# Altium schematic sheet SCP_Controller.SchDoc: SCP Fiber Controller (part 2 of 2)
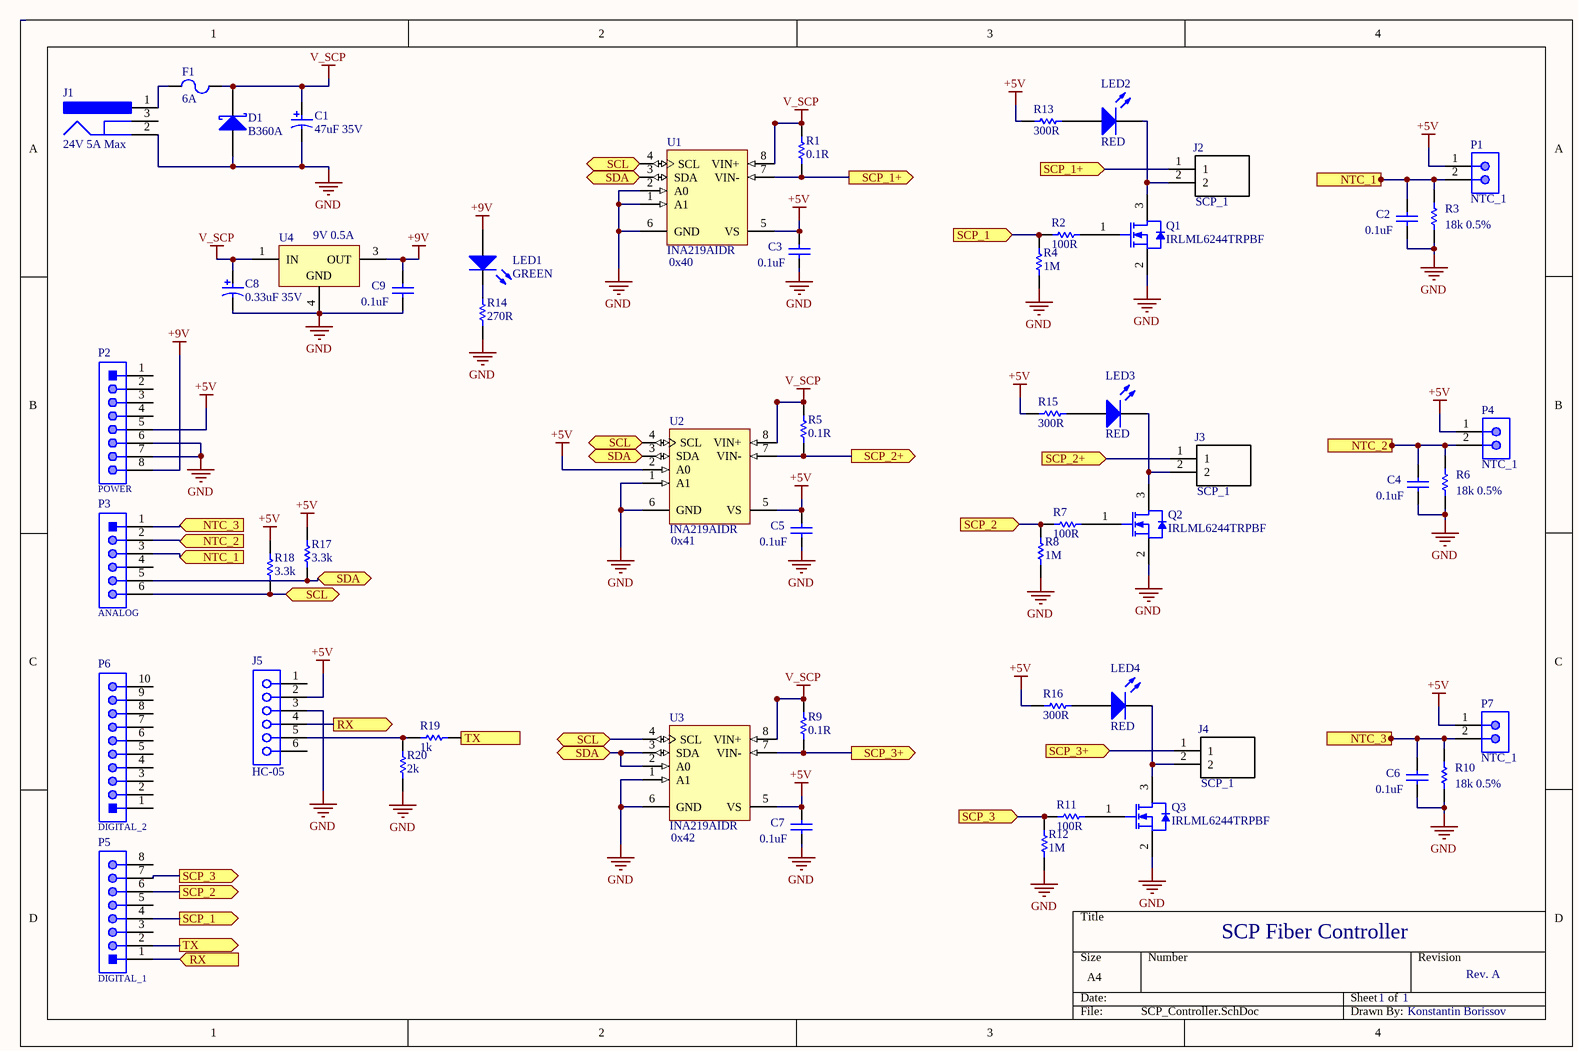
[diagram p1: SCP_Controller.SchDoc]

## Library data of the parts
C1 = CMP-2000-06216-1: Aluminum Electrolytic Capacitor, 47 uF, +/- 20%, 35 V, 2-Pin SMD (Size Code D), -55 to 105 degC, RoHS, Tape and Reel; Manufacturer: Panasonic; Manufacturer Part Number: EEE-1VA470WP; Ripple Current: 70mA; Life (Hours): 1000Hour; ComponentLink1URL: https://datasheet.ciiva.com/2983/aba0000ce2-2983927.pdf?src-supplier=Avnet; ComponentLink1Description: https://datasheet.ciiva.com/2983/aba0000ce2-2983927.pdf?src-supplier=Avnet; ComponentLink2URL: https://datasheet.ciiva.com/14598/70255710-14598937.pdf?src-supplier=Allied+Electronics; ComponentLink2Description: https://datasheet.ciiva.com/14598/70255710-14598937.pdf?src-supplier=Allied+Electronics; ComponentLink3URL: https://datasheet.ciiva.com/15165/getdatasheetpartid-86239-15165868.pdf?src-supplier=Verical; ComponentLink3Description: https://datasheet.ciiva.com/15165/getdatasheetpartid-86239-15165868.pdf?src-supplier=Verical; ComponentLink4URL: https://datasheet.ciiva.com/16507/aba0000ce2-16507965.pdf?src-supplier=Future+Electronics; ComponentLink4Description: https://datasheet.ciiva.com/16507/aba0000ce2-16507965.pdf?src-supplier=Future+Electronics; ComponentLink5URL: https://datasheet.ciiva.com/30206/11aba0000ce2-30206253.pdf?src-supplier=Onlinecomponents.com; ComponentLink5Description: https://datasheet.ciiva.com/30206/11aba0000ce2-30206253.pdf?src-supplier=Onlinecomponents.com; Supplier 1: Digi-Key; Supplier Part Number 1: PCE3961CT-ND; RoHS: Yes; Category: Aluminum Electrolytic Capacitors; Stock 1: 380414; Pricing 1: 1=0.41000, 10=0.28400, 100=0.17040, 500=0.12782 (USD); Mount: Surface Mount,PCB; Case/Package: Radial; Contact Plating: Tin; Min Operating Temperature: -40°C; Max Operating Temperature: 85°C; Capacitance: 47uF; Tolerance: 20%; Voltage Rating (DC): 35V; Voltage Rating: 35V; Packaging: Tape and Reel; Package Quantity: 1; Termination: SMD/SMT; Ripple Current (AC): 70mA; Diameter: 6.3mm; Length: 5.5mm; Height: 5.4mm; Height - Seated (Max): 0.213inch; Radiation Hardening: No; Lead Free: Lead Free; REACH SVHC: Unknown
C2-C7 C9 = CMP-2006-02353-1: Manufacturer: Murata; Manufacturer Part Number: GCJ188R71E104KA12D; Capacitance: 100nF; Tolerance: 10%; Voltage Rating: 25V; Supplier 1: Digi-Key; Supplier Part Number 1: 490-16477-1-ND; RoHS: No; Category: Ceramic Capacitors; Stock 1: 9578; Pricing 1: 1=0.20000, 10=0.13300, 100=0.06740, 500=0.04610, 1000=0.04079 (USD); Mount: Surface Mount; Case/Package: 0603; Case Code (Imperial): 0603; Case Code (Metric): 1608; Min Operating Temperature: -55°C; Max Operating Temperature: 125°C; Features: Soft Termination; Packaging: Tape and Reel; Ratings: AEC-Q200; ComponentLink1URL: http://search.murata.co.jp/Ceramy/image/img/A01X/G101/ENG/GCJ188R71E104KA12-01.pdf?src-supplier=Digi-Key; ComponentLink1Description: http://search.murata.co.jp/Ceramy/image/img/A01X/G101/ENG/GCJ188R71E104KA12-01.pdf?src-supplier=Digi-Key
C8 = CMP-2000-05172-1: Manufacturer: KEMET; Manufacturer Part Number: T491A334K035AT; Dielectric Material: Tantalum; Capacitance: 330nF; ESR (Equivalent Series Resistance): 15R; Tolerance: 10%; Leakage Current: 500nA; Polarity: Polar; Dissipation Factor: 4%; Life (Hours): 2000Hour; Supplier 1: Digi-Key; Supplier Part Number 1: 399-3693-1-ND; RoHS: Yes; Category: Tantalum Capacitors; Stock 1: 42469; Pricing 1: 1=0.45000, 10=0.31300, 100=0.18770, 500=0.14076, 1000=0.11886 (USD); Mount: Surface Mount,PCB; Case/Package: 1206; Number of Pins: 2; Case Code (Imperial): 1206; Case Code (Metric): 3216; Min Operating Temperature: -55°C; Max Operating Temperature: 125°C; Package Quantity: 1; Voltage Rating: 35V; Packaging: Tape and Reel; Voltage Rating (DC): 35V; Termination: SMD/SMT; Voltage: 35V; Features: General Purpose; Length: 3.2mm; Height: 1.6mm; Width: 1.6mm; Height - Seated (Max): 0.071inch; Depth: 1.6mm; Lead Pitch: 1.2mm; Radiation Hardening: No; REACH SVHC: No SVHC; Lead Free: Lead Free; ComponentLink1URL: https://datasheet.ciiva.com/34302/1573370-34302509.pdf?src-supplier=Jameco; ComponentLink1Description: https://datasheet.ciiva.com/34302/1573370-34302509.pdf?src-supplier=Jameco; ComponentLink2URL: https://datasheet.ciiva.com/7758/1446014-7758887.pdf?src-supplier=Element14; ComponentLink2Description: https://datasheet.ciiva.com/7758/1446014-7758887.pdf?src-supplier=Element14; ComponentLink3URL: https://datasheet.ciiva.com/7758/1698764-7758889.pdf?src-supplier=Element14; ComponentLink3Description: https://datasheet.ciiva.com/7758/1698764-7758889.pdf?src-supplier=Element14; ComponentLink4URL: https://datasheet.ciiva.com/257/kem-t2005-t491-257550.pdf?src-supplier=Digi-Key; ComponentLink4Description: https://datasheet.ciiva.com/257/kem-t2005-t491-257550.pdf?src-supplier=Digi-Key; ComponentLink5URL: https://datasheet.ciiva.com/7758/1446014-7758888.pdf?src-supplier=Element14; ComponentLink5Description: https://datasheet.ciiva.com/7758/1446014-7758888.pdf?src-supplier=Element14; ComponentLink6URL: https://datasheet.ciiva.com/7758/1446014-7758890.pdf?src-supplier=Element14; ComponentLink6Description: https://datasheet.ciiva.com/7758/1446014-7758890.pdf?src-supplier=Element14; ComponentLink7URL: https://datasheet.ciiva.com/5933/1446014-5933354.pdf?src-supplier=Farnell; ComponentLink7Description: https://datasheet.ciiva.com/5933/1446014-5933354.pdf?src-supplier=Farnell; ComponentLink8URL: https://datasheet.ciiva.com/14595/70095774-14595094.pdf?src-supplier=Allied+Electronics; ComponentLink8Description: https://datasheet.ciiva.com/14595/70095774-14595094.pdf?src-supplier=Allied+Electronics; ComponentLink9URL: https://datasheet.ciiva.com/257/kem-t2005-t491-257548.pdf?src-supplier=Digi-Key; ComponentLink9Description: https://datasheet.ciiva.com/257/kem-t2005-t491-257548.pdf?src-supplier=Digi-Key; ComponentLink10URL: https://datasheet.ciiva.com/14589/70095774-14589356.pdf?src-supplier=Allied+Electronics; ComponentLink10Description: https://datasheet.ciiva.com/14589/70095774-14589356.pdf?src-supplier=Allied+Electronics; ComponentLink11URL: https://datasheet.ciiva.com/257/kem-t2005-t491-257549.pdf?src-supplier=Digi-Key; ComponentLink11Description: https://datasheet.ciiva.com/257/kem-t2005-t491-257549.pdf?src-supplier=Digi-Key
D1 = CMP-2000-05898-1: Schottky Barrier Rectifier, 3 A, -55 to 150 degC, 2-Pin Molded, RoHS, Tape and Reel; Manufacturer: DiodesIncorporated; Manufacturer Part Number: B360A-13-F; Vf - Forward Voltage: 0.7V; Ifsm - Forward Surge Current: 80A; If - Forward Current: 3A; Unit Weight: 0.002258oz; Ir - Reverse Current: 500uA; Vrrm - Repetitive Reverse Voltage: 60V; Configuration: Single; Forward Voltage: 700mV; Polarity: Standard; Capacitance: 250pF; Length: 4.6mm; Datasheet Version: Rev. 15-2, 09/2014; Technology: Si; Factory Pack Quantity: 5000; Manufacturer URL: http://www.diodes.com/; Type: SchottkyBarrierRectifier; Product Category: SchottkyDiodes&Rectifiers; Minimum Operating Temperature: -55C; Packaging: Reel; Product: SchottkyDiodes; Height: 2.3mm; Datasheet URL: https://datasheet.ciiva.com/914/ds30891-914080.pdf; Series: B360; Brand: DiodesIncorporated; Maximum Operating Temperature: +125C; Termination Style: SMD/SMT; Package / Case: SMA; Mounting Style: SMD/SMT; RoHS: True; Package Description: 2-Pin Surface Mount Device, Body 4.3 x 2.605 mm; Operating Temperature Range: -55Cto+125C; Package Reference: B360A; Width: 2.92mm; Mounting Technology: SurfaceMount; Supplier 1: Digi-Key; Supplier Part Number 1: B360A-FDIDKR-ND; Category: Schottky Diodes; Stock 1: 514772; Pricing 1: 1=0.38000, 10=0.30800, 100=0.17690, 500=0.16380, 1000=0.11138 (USD); Mount: Surface Mount; Case/Package: SMA; Number of Pins: 2; Weight: 0.002258oz; Contact Plating: Tin,Matte; Min Operating Temperature: -55°C; Max Operating Temperature: 150°C; Forward Current: 3A; Max Repetitive Reverse Voltage (Vrrm): 60V; Element Configuration: Single; Peak Reverse Current: 500uA; Max Forward Surge Current (Ifsm): 80A; Peak Non-Repetitive Surge Current: 80A; Package Quantity: 5000; Average Rectified Current: 3A; Termination: SMD/SMT; Voltage Rating (DC): 60V; Current Rating: 3A; Output Current: 3A; Max Reverse Voltage (DC): 60V; Radiation Hardening: No; REACH SVHC: No SVHC; Lead Free: Lead Free; ComponentLink1URL: https://datasheet.ciiva.com/914/ds30891-914080.pdf?src-supplier=Digi-Key; ComponentLink1Description: https://datasheet.ciiva.com/914/ds30891-914080.pdf?src-supplier=Digi-Key; ComponentLink2URL: https://datasheet.ciiva.com/4244/861ds30891-4244631.pdf?src-supplier=Arrow; ComponentLink2Description: https://datasheet.ciiva.com/4244/861ds30891-4244631.pdf?src-supplier=Arrow; ComponentLink3URL: https://datasheet.ciiva.com/34302/1538902-34302361.pdf?src-supplier=Jameco; ComponentLink3Description: https://datasheet.ciiva.com/34302/1538902-34302361.pdf?src-supplier=Jameco; ComponentLink4URL: https://datasheet.ciiva.com/26788/b360a-13-f-26788524.pdf?src-supplier=IIIC; ComponentLink4Description: https://datasheet.ciiva.com/26788/b360a-13-f-26788524.pdf?src-supplier=IIIC; ComponentLink5URL: https://datasheet.ciiva.com/914/ds30891-914081.pdf?src-supplier=Digi-Key; ComponentLink5Description: https://datasheet.ciiva.com/914/ds30891-914081.pdf?src-supplier=Digi-Key; ComponentLink6URL: https://datasheet.ciiva.com/1177/ds30891-1177482.pdf?src-supplier=Element14; ComponentLink6Description: https://datasheet.ciiva.com/1177/ds30891-1177482.pdf?src-supplier=Element14; ComponentLink7URL: https://datasheet.ciiva.com/914/ds30891-914082.pdf?src-supplier=Digi-Key; ComponentLink7Description: https://datasheet.ciiva.com/914/ds30891-914082.pdf?src-supplier=Digi-Key; ComponentLink8URL: https://datasheet.ciiva.com/25919/ds30891-25919703.pdf?src-supplier=Avnet+Europe; ComponentLink8Description: https://datasheet.ciiva.com/25919/ds30891-25919703.pdf?src-supplier=Avnet+Europe; ComponentLink9URL: https://datasheet.ciiva.com/22695/1911813-22695787.pdf?src-supplier=Element14; ComponentLink9Description: https://datasheet.ciiva.com/22695/1911813-22695787.pdf?src-supplier=Element14; ComponentLink10URL: https://datasheet.ciiva.com/16199/ds13005-16199422.pdf?src-supplier=Future+Electronics; ComponentLink10Description: https://datasheet.ciiva.com/16199/ds13005-16199422.pdf?src-supplier=Future+Electronics
F1 = CMP-2000-05753-1: Manufacturer: Bel TRP; Manufacturer Part Number: C1F6; Voltage Rating (AC): 125V; Voltage Rating (DC): 63V; DC Cold Resistance: 15mR; Fuse Type: Board Mount (Cartridge Style Excluded); Approvals: CE,cURus; Supplier 1: Digi-Key; Supplier Part Number 1: 507-1887-1-ND; RoHS: Yes; Category: Fuses; Stock 1: 11906; Pricing 1: 1=0.29000, 5=0.27800, 10=0.26500, 50=0.23660, 100=0.22030, 250=0.19584, 500=0.16320, 1000=0.15504 (USD); Mount: Surface Mount; Case/Package: 1206; Number of Pins: 2; Case Code (Metric): 3216; Case Code (Imperial): 1206; Contact Plating: Tin; Min Operating Temperature: -55°C; Max Operating Temperature: 125°C; Packaging: Tape and Reel; Current Rating: 6A; Max Voltage Rating (DC): 63V; Voltage Rating: 125V; Length: 0.126inch; Width: 0.062inch; ComponentLink1URL: http://www.farnell.com/datasheets/2571625.pdf?src-supplier=Farnell; ComponentLink1Description: http://www.farnell.com/datasheets/2571625.pdf?src-supplier=Farnell; ComponentLink2URL: http://www.mouser.com/ds/2/643/C1F-594910.pdf?src-supplier=Mouser; ComponentLink2Description: http://www.mouser.com/ds/2/643/C1F-594910.pdf?src-supplier=Mouser; ComponentLink3URL: http://belfuse.com/pdfs/C1F.pdf?src-supplier=Avnet+Asia; ComponentLink3Description: http://belfuse.com/pdfs/C1F.pdf?src-supplier=Avnet+Asia; ComponentLink4URL: http://belfuse.com/pdfs/C1F.pdf?src-supplier=Avnet; ComponentLink4Description: http://belfuse.com/pdfs/C1F.pdf?src-supplier=Avnet; ComponentLink5URL: https://belfuse.com/resources/datasheets/circuitprotection/ds-cp-c1f-series.pdf?src-supplier=Digi-Key; ComponentLink5Description: https://belfuse.com/resources/datasheets/circuitprotection/ds-cp-c1f-series.pdf?src-supplier=Digi-Key
J1 = CMP-2000-06899-1: DC Power Jack, 5 A, -25 to 85 degC, 3-Pin THD, RoHS; Manufacturer: CUI; Manufacturer Part Number: PJ-102AH; Gender: Male; Shielding: Unshielded; Insulation Resistance: 50MR; Number of Conductors: 2; ComponentLink1URL: http://www.mouser.com/ds/2/670/PJ-102AH-524179.pdf?src-supplier=Mouser; ComponentLink1Description: http://www.mouser.com/ds/2/670/PJ-102AH-524179.pdf?src-supplier=Mouser; ComponentLink2URL: http://www.cui.com/Product/Resource/FuturePDF/PJ-102AH.pdf?src-supplier=Future+Electronics; ComponentLink2Description: http://www.cui.com/Product/Resource/FuturePDF/PJ-102AH.pdf?src-supplier=Future+Electronics; ComponentLink3URL: https://www.cui.com/product/resource/digikeypdf/pj-102ah.pdf?src-supplier=Digi-Key; ComponentLink3Description: https://www.cui.com/product/resource/digikeypdf/pj-102ah.pdf?src-supplier=Digi-Key; Supplier 1: Digi-Key; Supplier Part Number 1: CP-102AH-ND; RoHS: Yes; Category: Connectors; Stock 1: 92806; Pricing 1: 1=0.76000, 10=0.70800, 25=0.63720, 50=0.56640, 100=0.54280, 250=0.49560, 500=0.47200, 1000=0.38940, 2500=0.35400 (USD); Mount: Through Hole; Color: Black; Contact Material: Copper; Contact Plating: Nickel; Housing Color: Black; Housing Material: Thermoplastic; Min Operating Temperature: -25°C; Max Operating Temperature: 85°C; Current Rating: 5A; Termination: Through Hole; Connector Type: Jack; Packaging: Bulk; Package Quantity: 280; Contact Gender: Male; Voltage Rating: 24V; Orientation: Horizontal; Diameter: 2.1mm; Lead Free: Lead Free; Flammability Rating: UL94 V-0
J2-J4 = TBP02R1-381-02BE: Manufacturer: CUI; Value: *; Supplier 1: Digi-Key; Supplier Part Number 1: 102-6480-ND; Manufacturer Part Number: TBP02R1-381-02BE; RoHS: No; Stock 1: 924; Pricing 1: 1=0.47000, 10=0.24600, 25=0.17440, 50=0.14820, 100=0.14300, 250=0.12092, 500=0.11180, 1000=0.09880, 5000=0.07540 (USD)
J5 = CMP-1023-00360-1: SQ Post Socket, Through-hole, Vertical, -55 to 105 degC, 2.54mm Pitch, 6-Pin, Female, RoHS; Manufacturer: Samtec; PartNumber: SSW-106-02-T-S; Manufacturer Part Number: PPPC061LFBN-RC; Description: CONN HDR 6POS 0.1 GOLD PCB; Number of Positions: 6; Connector Type: Header,Socket; ComponentLink1URL: http://www.samtec.com; Temperature Range: -55 to 105 degC; Pitch: 2.54 mm; Mounting Technology: Through-hole; DatasheetVersion: F-214; ComponentLink1Description: Manufacturer URL; PackageVersion: CA, 6/1987; ComponentLink3Description: Package Specification; PackageDescription: Assembly, Socket Strip .016 X .031 Tail; ComponentLink2Description: Datasheet; ComponentLink2URL: http://www.samtec.com/documents/webfiles/pdf/SSW_TH.PDF; PackageReference: SSW-106-02-X-S; ComponentLink3URL: http://www.samtec.com/documents/webfiles/cpdf/SSW-1XX-XX-XXX-X-XX-XXX-XX-MKT.pdf; RoHS: True; Orientation: Vertical; Supplier 1: Digi-Key; Supplier Part Number 1: S7039-ND; Category: Connectors; Stock 1: 24151; Pricing 1: 1=0.53000, 10=0.50000, 100=0.38300, 500=0.33300, 1000=0.27473, 5000=0.24143, 10000=0.24050 (USD); Mount: Through Hole; Color: Black; Contact Plating: Gold; Contact Material: Bronze; Housing Material: Plastic; Package Quantity: 1000; Number of Rows: 1; Packaging: Bulk; Termination: Solder; Length: 15.7mm; Height: 8.5mm; Width: 2.5mm; Lead Free: Lead Free; ComponentLink4URL: https://media.digikey.com/pdf/Data%20Sheets/Sullins%20PDFs/Female_Headers.100_DS.pdf?src-supplier=Digi-Key; ComponentLink4Description: https://media.digikey.com/pdf/Data%20Sheets/Sullins%20PDFs/Female_Headers.100_DS.pdf?src-supplier=Digi-Key
LED1 = CMP-1426-00006-1: SMD mono-color Chip LED, WL-SMCW, Bright Green; PartNumber: 150060VS75000; Manufacturer: Wuerth Elektronik; Luminous Intensity: 40mcd; Viewing Angle: 140°; Forward Voltage: 2V; Wavelength: 570nm; Lens Style: Clear,Rectangular; Forward Current: 30mA; Test Current: 20mA; ComponentLink2URL: http://katalog.we-online.com/led/datasheet/150060VS75000.pdf; ComponentLink1Description: Manufacturer URL; PackageReference: 0603_A; ComponentLink2Description: Datasheet; ComponentLink1URL: http://www.we-online.com; Color: Bright Green; Supplier 1: Digi-Key; Supplier Part Number 1: 732-4980-1-ND; Manufacturer Part Number: 150060VS75000; RoHS: Yes; Category: LEDs; Stock 1: 59962; Pricing 1: 1=0.14000, 50=0.13300, 100=0.11400, 500=0.09900 (USD); Mount: Surface Mount; Case/Package: 0603; Number of Pins: 2; Case Code (Metric): 1608; Case Code (Imperial): 0603; Min Operating Temperature: -40°C; Max Operating Temperature: 85°C; Package Quantity: 1; Packaging: Tape and Reel; Dominant Wavelength: 570nm; Length: 1.6mm; Height: 0.7mm; Width: 0.8mm; REACH SVHC: Unknown; ComponentLink3URL: https://datasheet.ciiva.com/23843/150060vs75000-23843249.pdf?src-supplier=Newark; ComponentLink3Description: https://datasheet.ciiva.com/23843/150060vs75000-23843249.pdf?src-supplier=Newark; ComponentLink4URL: https://datasheet.ciiva.com/29279/759431-da-01-en-chipled-0603-w-kl-h-gruen-150060vs7500-29279199.pdf?src-supplier=Conrad; ComponentLink4Description: https://datasheet.ciiva.com/29279/759431-da-01-en-chipled-0603-w-kl-h-gruen-150060vs7500-29279199.pdf?src-supplier=Conrad; ComponentLink5URL: https://datasheet.ciiva.com/29562/150060vs75000-29562919.pdf?src-supplier=Digi-Key; ComponentLink5Description: https://datasheet.ciiva.com/29562/150060vs75000-29562919.pdf?src-supplier=Digi-Key; ComponentLink6URL: https://datasheet.ciiva.com/29562/150060vs75000-29562920.pdf?src-supplier=Digi-Key; ComponentLink6Description: https://datasheet.ciiva.com/29562/150060vs75000-29562920.pdf?src-supplier=Digi-Key; ComponentLink7URL: https://datasheet.ciiva.com/29562/150060vs75000-29562921.pdf?src-supplier=Digi-Key; ComponentLink7Description: https://datasheet.ciiva.com/29562/150060vs75000-29562921.pdf?src-supplier=Digi-Key; ComponentLink8URL: https://datasheet.ciiva.com/48430/150060vs75000-eng-tds-48430043.pdf?src-supplier=Distrelec; ComponentLink8Description: https://datasheet.ciiva.com/48430/150060vs75000-eng-tds-48430043.pdf?src-supplier=Distrelec
LED2-LED4 = CMP-1426-00001-1: SMD mono-color Chip LED, WL-SMCW, Red; Manufacturer: Wuerth Elektronik; PartNumber: 150060RS75000; Viewing Angle: 140°; Lens Style: Clear,Rectangular; Luminous Intensity: 250mcd; Forward Current: 30mA; Forward Voltage: 2V; Wavelength: 625nm; Test Current: 20mA; Color: Red; PackageReference: 0603_A; ComponentLink2URL: http://katalog.we-online.com/led/datasheet/150060RS75000.pdf; ComponentLink1URL: http://www.we-online.com; ComponentLink1Description: Manufacturer URL; ComponentLink2Description: Datasheet; Supplier 1: Digi-Key; Supplier Part Number 1: 732-4978-1-ND; Manufacturer Part Number: 150060RS75000; RoHS: Yes; Category: LEDs; Stock 1: 19848; Pricing 1: 1=0.14000, 50=0.13300, 100=0.11400, 500=0.09900 (USD); Mount: Surface Mount; Case/Package: 0603; Case Code (Metric): 1608; Case Code (Imperial): 0603; Min Operating Temperature: -40°C; Max Operating Temperature: 85°C; Package Quantity: 1; Packaging: Cut Tape; Dominant Wavelength: 625nm; Length: 1.6mm; Height: 0.7mm; Width: 0.8mm; REACH SVHC: Unknown; ComponentLink3URL: https://datasheet.ciiva.com/29563/150060rs75000-29563040.pdf?src-supplier=Digi-Key; ComponentLink3Description: https://datasheet.ciiva.com/29563/150060rs75000-29563040.pdf?src-supplier=Digi-Key; ComponentLink4URL: https://datasheet.ciiva.com/29279/759428-da-01-en-chipled-0603-w-kl-rot-150060rs75000-29279196.pdf?src-supplier=Conrad; ComponentLink4Description: https://datasheet.ciiva.com/29279/759428-da-01-en-chipled-0603-w-kl-rot-150060rs75000-29279196.pdf?src-supplier=Conrad
P1 P4 P7 = CMP-2000-05888-1: Male Header, Pitch 2.5 mm, 1 x 2 Position, Height 7 mm, Tail Length 3.4 mm, -25 to 85 degC, RoHS, Bulk; Manufacturer: JST; No of Positions: 2; Pitch: 2.5mm; Style/Orientation: StraightHeader/Plug; Datasheet Version: 05/2016; Package Description: Male Header, Pitch 2.5 mm, 1 x 2 Position, Height 7 mm, Tail Length 3.4 mm; Package Reference: B2B-XH-A; Mounting Technology: ThroughHole; Type: ShroudedHeader; Datasheet URL: http://www.jst-mfg.com/product/pdf/eng/eXH.pdf; Manufacturer URL: http://www.jst.com/home2.html; Termination: Crimp; Supplier 1: Digi-Key; Supplier Part Number 1: 455-2247-ND
P2 P5 = CMP-1502-01076-1: THT Vertical Pin Header WR-PHD, Pitch 2.54 mm, Single Row, 8 pins; Manufacturer: Wurth Elektronik; Rated Current: 3A; Pin Number: 8; Working Voltage: 250VAC; Gender: Male; Contact Resistance: 20mOhm; Pitch: 2.54mm; Withstanding Voltage: 500VAC; Publisher: WurthElektronik; Operating Temperature: -40to105degC; Orientation: Vertical; Row Number: Single; Part Number: 61300811121; Package Reference: 61300811121; Mounting Technology: THT; Packaging: Bag; Manufacturer URL: http://www.we-online.de; Datasheet URL: https://katalog.we-online.de/em/datasheet/6130xx11121.pdf; Supplier 1: Digi-Key; Supplier Part Number 1: 732-5321-ND
P3 = CMP-1502-01070-1: THT Vertical Pin Header WR-PHD, Pitch 2.54 mm, Single Row, 6 pins; Manufacturer: Wurth Elektronik; Gender: Male; Pin Number: 6; Pitch: 2.54mm; Working Voltage: 250VAC; Rated Current: 3A; Withstanding Voltage: 500VAC; Contact Resistance: 20mOhm; Operating Temperature: -40to105degC; Packaging: Bag; Datasheet URL: https://katalog.we-online.de/em/datasheet/6130xx11121.pdf; Package Reference: 61300611121; Mounting Technology: THT; Publisher: WurthElektronik; Part Number: 61300611121; Manufacturer URL: http://www.we-online.de; Row Number: Single; Orientation: Vertical; Supplier 1: Digi-Key; Supplier Part Number 1: 732-5319-ND
P6 = CMP-1502-01082-1: THT Vertical Pin Header WR-PHD, Pitch 2.54 mm, Single Row, 10 pins; Manufacturer: Wurth Elektronik; Contact Resistance: 20mOhm; Rated Current: 3A; Pitch: 2.54mm; Gender: Male; Pin Number: 10; Working Voltage: 250VAC; Withstanding Voltage: 500VAC; Manufacturer URL: http://www.we-online.de; Operating Temperature: -40to105degC; Datasheet URL: https://katalog.we-online.de/em/datasheet/6130xx11121.pdf; Row Number: Single; Orientation: Vertical; Part Number: 61301011121; Packaging: Bag; Package Reference: 61301011121; Mounting Technology: THT; Publisher: WurthElektronik; Supplier 1: Digi-Key; Supplier Part Number 1: 732-2670-ND
Q1-Q3 = CMP-2000-06486-1: HEXFET(R) Power MOSFET / , 20 V, -55 to 150 degC, 3-Pin SOT-23, RoHS, Tape and Reel; Manufacturer: International Rectifier; Maximum Drain Source Voltage: 20V; Typical Turn-On Delay Time: 4.9ns; Typical Gate Charge @ Vgs: 8.9nC@4.5V; Maximum Continuous Drain Current: 6.3A; Channel Type: N; Channel Mode: Enhancement; Number of Elements per Chip: 1; Maximum Gate Threshold Voltage: 1.1V; Typical Input Capacitance @ Vds: 700pF@16V; Maximum Gate Source Voltage: ±12V; Transistor Material: Si; Maximum Drain Source Resistance: 0.027Ω; Minimum Gate Threshold Voltage: 0.5V; Transistor Configuration: Single; Maximum Power Dissipation: 1.3W; Typical Turn-Off Delay Time: 19ns; Category: PowerMOSFET; Manufacturer URL: http://internationalrectifier.com/; Datasheet Version: 03/2012; Mounting Type: SurfaceMount; Length: 3.04mm; Width: 1.4mm; Maximum Operating Temperature: +150°C; Height: 1.02mm; Datasheet URL: http://www.irf.com/product-info/datasheets/data/irlml6244pbf.pdf; Package Reference: SOT-23; Package Description: 3-Pin Small Outline Transistor, Body 2.92 x 1.3 mm, Pitch 0.95 mm; Minimum Operating Temperature: -55°C; Pin Count: 3; Dimensions: 3.04x1.4x1.02mm; Package Type: SOT-23; Mounting Technology: SurfaceMount; Supplier 1: Digi-Key; Supplier Part Number 1: IRLML6244TRPBFCT-ND
R1 R5 R9 = CMP-2000-07420-1: RES 0.1 OHM 1% 1W 2512; Manufacturer: Yageo; Manufacturer Part Number: RL2512FK-070R1L; Resistance: 100mR; Tolerance: 5%; Voltage Rating: 500V; Temperature Coefficient: 600ppm/°C; Supplier 1: Digi-Key; Supplier Part Number 1: 311-0.1TCT-ND; RoHS: Yes; Category: Chip SMD Resistors; Stock 1: 28825; Pricing 1: 1=0.54000, 10=0.38200, 100=0.19890, 1000=0.10709 (USD); Case/Package: 2512; Case Code (Imperial): 2512; Case Code (Metric): 6432; Contact Plating: Tin,Lead; Min Operating Temperature: -55°C; Max Operating Temperature: 155°C; Power Rating: 1W; Packaging: Tape and Reel; Package Quantity: 4000; Termination: SMD/SMT; Composition: Thick Film; Number of Terminations: 2; Max Power Dissipation: 1W; Features: Moisture Resistant; Length: 0.25inch; Height: 0.026inch; Width: 0.126inch; REACH SVHC: Unknown; Lead Free: Lead Free; ComponentLink1URL: https://datasheet.ciiva.com/22698/1747499-22698992.pdf?src-supplier=Element14; ComponentLink1Description: https://datasheet.ciiva.com/22698/1747499-22698992.pdf?src-supplier=Element14; ComponentLink2URL: https://datasheet.ciiva.com/5558/pyu-rl-521-rohs-l-5-5558076.pdf?src-supplier=Mouser; ComponentLink2Description: https://datasheet.ciiva.com/5558/pyu-rl-521-rohs-l-5-5558076.pdf?src-supplier=Mouser
R2 R7 R11 = CMP-2100-03669-1: Chip Resistor, 100 Ohm, +/-1%, 0.125 W, -55 to 155 degC, 0805 (2012 Metric), RoHS, Tape and Reel; Manufacturer: Yageo; Manufacturer Part Number: RC0805FR-07100RL; Power Rating: 125mW; Resistance: 100Ohm; Voltage Rating: 150V; Tolerance: 1%; Temperature Coefficient: 100ppm/degreesC; Length: 2mm; Package Description: 2-Pin Surface Mounted Device, Body 2 x 1.25 mm; Case Code (Imperial): 0805; Number of Pins: 2; Termination: SMD/SMT; Lead Pitch: 0.4mm; Package Quantity: 1; Height: 0.024inch; Case Code (Metric): 2012; Number of Terminations: 2; Datasheet Version: Rev. 5, 10/2016; Lead Free: LeadFree; Package Reference: 0805; Composition: ThickFilm; REACH SVHC: Unknown; Voltage Rating (DC): 150V; Min Operating Temperature: -55degC; Packaging: TapeandReel; Military Standard: Not; Case/Package: 0805; Datasheet URL: http://www.yageo.com/NewPortal/yageodocoutput?fileName=/pdf/R-Chip/PYu-RC_Group_51_RoHS_L_5.pdf; Max Operating Temperature: 155degC; Manufacturer URL: http://www.yageo.com/; Max Power Dissipation: 125mW; Width: 0.049inch; Depth: 1.25mm; RoHSCompliant: true; Supplier 1: Digi-Key; Supplier Part Number 1: 311-100CRCT-ND; RoHS: Yes; Category: Chip SMD Resistors; Stock 1: 7597433; Pricing 1: 1=0.10000, 10=0.04000, 100=0.01630, 1000=0.00731, 2500=0.00635 (USD); Features: Moisture Resistant; ComponentLink1URL: https://datasheet.ciiva.com/7941/1697719-7941680.pdf?src-supplier=Element14; ComponentLink1Description: https://datasheet.ciiva.com/7941/1697719-7941680.pdf?src-supplier=Element14; ComponentLink2URL: https://datasheet.ciiva.com/11808/0900766b8106beab-11808877.pdf?src-supplier=RSComponents; ComponentLink2Description: https://datasheet.ciiva.com/11808/0900766b8106beab-11808877.pdf?src-supplier=RSComponents; ComponentLink3URL: https://datasheet.ciiva.com/17082/rc0805-17082697.pdf?src-supplier=Future+Electronics; ComponentLink3Description: https://datasheet.ciiva.com/17082/rc0805-17082697.pdf?src-supplier=Future+Electronics; ComponentLink4URL: https://datasheet.ciiva.com/46447/444164-46447562.pdf?src-supplier=Element14; ComponentLink4Description: https://datasheet.ciiva.com/46447/444164-46447562.pdf?src-supplier=Element14; ComponentLink5URL: https://datasheet.ciiva.com/2456/pyu-r-int-thick-7-2456987.pdf?src-supplier=Digi-Key; ComponentLink5Description: https://datasheet.ciiva.com/2456/pyu-r-int-thick-7-2456987.pdf?src-supplier=Digi-Key; ComponentLink6URL: https://datasheet.ciiva.com/2456/pyu-r-int-thick-7-2456988.pdf?src-supplier=Digi-Key; ComponentLink6Description: https://datasheet.ciiva.com/2456/pyu-r-int-thick-7-2456988.pdf?src-supplier=Digi-Key; ComponentLink7URL: https://datasheet.ciiva.com/2456/pyu-r-int-thick-7-2456989.pdf?src-supplier=Digi-Key; ComponentLink7Description: https://datasheet.ciiva.com/2456/pyu-r-int-thick-7-2456989.pdf?src-supplier=Digi-Key; ComponentLink8URL: https://datasheet.ciiva.com/7660/38627-7660797.pdf?src-supplier=Element14; ComponentLink8Description: https://datasheet.ciiva.com/7660/38627-7660797.pdf?src-supplier=Element14; ComponentLink9URL: https://datasheet.ciiva.com/7941/1686128-7941679.pdf?src-supplier=Element14; ComponentLink9Description: https://datasheet.ciiva.com/7941/1686128-7941679.pdf?src-supplier=Element14; ComponentLink10URL: https://datasheet.ciiva.com/22747/444164-22747535.pdf?src-supplier=Element14; ComponentLink10Description: https://datasheet.ciiva.com/22747/444164-22747535.pdf?src-supplier=Element14
R3 R6 R10 = CMP-2001-00364-1: Manufacturer: Panasonic; Manufacturer Part Number: ERA-6AED183V; Resistance: 18kR; Power Rating: 125mW; Voltage Rating: 100V; Temperature Coefficient: 25ppm/°C; Supplier 1: Digi-Key; Supplier Part Number 1: P123817CT-ND; RoHS: Yes; Category: Chip SMD Resistors; Stock 1: 15192; Pricing 1: 1=0.11000, 10=0.10300, 25=0.07120, 50=0.05540, 100=0.03960, 250=0.03088, 500=0.02456, 1000=0.01742 (USD); Mount: Surface Mount; Case/Package: 0805; Case Code (Imperial): 0805; Case Code (Metric): 2012; Contact Plating: Tin; Min Operating Temperature: -55°C; Max Operating Temperature: 155°C; Package Quantity: 5000; Packaging: Tape and Reel; Tolerance: 0.5%; Composition: Thin Film; Military Standard: Not; Length: 2mm; Height: 0.5mm; Width: 1.25mm; Depth: 1.25mm; Lead Free: Lead Free; ComponentLink1URL: https://datasheet.ciiva.com/9192/aoa0000ce26-9192506.pdf?src-supplier=Avnet; ComponentLink1Description: https://datasheet.ciiva.com/9192/aoa0000ce26-9192506.pdf?src-supplier=Avnet
R4 R8 R12 = CMP-2001-00364-1: Manufacturer: Yageo; Manufacturer Part Number: RC0805FR-071ML; Resistance: 1MR; Tolerance: 1%; Temperature Coefficient: 100ppm/°C; Power Rating: 125mW; Voltage Rating: 150V; Supplier 1: Digi-Key; Supplier Part Number 1: 311-1.00MCRCT-ND; RoHS: Yes; Category: Chip SMD Resistors; Stock 1: 5090865; Pricing 1: 1=0.100000, 10=0.040000, 100=0.016300, 1000=0.007310, 2500=0.006350 (USD); Case/Package: 0805; Case Code (Metric): 2012; Case Code (Imperial): 0805; Min Operating Temperature: -55°C; Max Operating Temperature: 155°C; Composition: Thick Film; Packaging: Tape and Reel; Package Quantity: 1; Number of Terminations: 2; Termination: SMD/SMT; Military Standard: Not; Max Power Dissipation: 125mW; Features: Moisture Resistant; Length: 0.079inch; Height: 0.024inch; Width: 0.049inch; Depth: 1.25mm; REACH SVHC: Unknown; Lead Free: Lead Free; ComponentLink1URL: https://datasheet.ciiva.com/2519/pyu-r-int-thick-7-2519713.pdf?src-supplier=Digi-Key; ComponentLink1Description: https://datasheet.ciiva.com/2519/pyu-r-int-thick-7-2519713.pdf?src-supplier=Digi-Key; ComponentLink2URL: https://datasheet.ciiva.com/12666/rc0805-12666975.pdf?src-supplier=Mouser; ComponentLink2Description: https://datasheet.ciiva.com/12666/rc0805-12666975.pdf?src-supplier=Mouser; ComponentLink3URL: https://datasheet.ciiva.com/2519/pyu-r-int-thick-7-2519712.pdf?src-supplier=Digi-Key; ComponentLink3Description: https://datasheet.ciiva.com/2519/pyu-r-int-thick-7-2519712.pdf?src-supplier=Digi-Key; ComponentLink4URL: https://datasheet.ciiva.com/17419/rc0805-17419909.pdf?src-supplier=Future+Electronics; ComponentLink4Description: https://datasheet.ciiva.com/17419/rc0805-17419909.pdf?src-supplier=Future+Electronics; ComponentLink5URL: https://datasheet.ciiva.com/2519/pyu-r-int-thick-7-2519711.pdf?src-supplier=Digi-Key; ComponentLink5Description: https://datasheet.ciiva.com/2519/pyu-r-int-thick-7-2519711.pdf?src-supplier=Digi-Key
R13 R15 R16 = CMP-2000-06960-1: Chip Resistor, 300 Ohm, +/- 1%, 125 mW, -55 to 155 degC, 0805 (2012 Metric), RoHS, Tape and Reel; Manufacturer: Yageo; Manufacturer Part Number: RC0805FR-07300RL; Voltage Rating: 150V; Temperature Coefficient: 100PPM/C; Power Rating: 125mW(1/8W); Datasheet Version: Rev. 7, 05/2017; Termination Style: SMD/SMT; Case Code - mm: 2012; Package Description: 2-Pin Surface Mounted Device, Body 2 x 1.25 mm; Operating Temperature Range: -55Cto+155C; Case Code - in: 0805; Packaging: Reel; Tolerance: 1%; Package Reference: 0805; Mounting Technology: SurfaceMount; Product: ThickFilmResistorsGeneralPurpose; Series: RC; Manufacturer URL: http://www.yageo.com/; Datasheet URL: http://www.yageo.com/documents/recent/PYu-RC_Group_51_RoHS_L_7.pdf; Supplier 1: Digi-Key; Supplier Part Number 1: 311-300CRCT-ND; RoHS: Yes; Category: Chip SMD Resistors; Stock 1: 1132617; Pricing 1: 1=0.10000, 10=0.04000, 100=0.01630, 1000=0.00731, 2500=0.00635 (USD); Mount: Surface Mount; Case/Package: 0805; Case Code (Imperial): 0805; Case Code (Metric): 2012; Min Operating Temperature: -55°C; Max Operating Temperature: 155°C; Resistance: 300R; Termination: SMD/SMT; Military Standard: Not; Composition: Thick Film; Voltage Rating (DC): 150V; Number of Terminations: 2; Working Voltage: 150V; Length: 2mm; Height: 0.5mm; Depth: 1.25mm; Lead Free: Lead Free; ComponentLink1URL: https://datasheet.ciiva.com/11819/0900766b8106beab-11819824.pdf?src-supplier=RSComponents; ComponentLink1Description: https://datasheet.ciiva.com/11819/0900766b8106beab-11819824.pdf?src-supplier=RSComponents; ComponentLink2URL: https://datasheet.ciiva.com/5558/rc0805-5558042.pdf?src-supplier=Mouser; ComponentLink2Description: https://datasheet.ciiva.com/5558/rc0805-5558042.pdf?src-supplier=Mouser; ComponentLink3URL: https://datasheet.ciiva.com/15189/getdatasheetpartid-328116-15189946.pdf?src-supplier=Verical; ComponentLink3Description: https://datasheet.ciiva.com/15189/getdatasheetpartid-328116-15189946.pdf?src-supplier=Verical
R14 = CMP-2000-06960-1: Chip Resistor, 270 Ohm, +/- 1%, 125 mW, -55 to 155 degC, 0805 (2012 Metric), RoHS, Tape and Reel; Manufacturer: Yageo; Manufacturer Part Number: RC0805FR-07270RL; Temperature Coefficient: 100ppm/°C; Power Rating: 125mW; Voltage Rating: 150V; Supplier 1: Digi-Key; Supplier Part Number 1: 311-270CRCT-ND; RoHS: Yes; Category: Chip SMD Resistors; Stock 1: 297425; Pricing 1: 1=0.10000, 10=0.04000, 100=0.01630, 1000=0.00731, 2500=0.00635 (USD); Case/Package: 0805; Number of Pins: 2; Weight: 0.000194oz; Case Code (Metric): 2012; Case Code (Imperial): 0805; Min Operating Temperature: -55°C; Max Operating Temperature: 155°C; Packaging: Tape and Reel; Resistance: 270R; Tolerance: 1%; Composition: Thick Film; Voltage Rating (DC): 150V; Number of Terminations: 2; Termination: SMD/SMT; Military Standard: Not; Package Quantity: 1; Max Power Dissipation: 125mW; Features: Moisture Resistant; Length: 2mm; Height: 0.5mm; Width: 1.25mm; Depth: 1.25mm; Lead Pitch: 0.4mm; REACH SVHC: Unknown; Lead Free: Lead Free; ComponentLink1URL: https://datasheet.ciiva.com/11819/0900766b8106beab-11819832.pdf?src-supplier=RSComponents; ComponentLink1Description: https://datasheet.ciiva.com/11819/0900766b8106beab-11819832.pdf?src-supplier=RSComponents; ComponentLink2URL: https://datasheet.ciiva.com/2457/pyu-r-int-thick-7-2457203.pdf?src-supplier=Digi-Key; ComponentLink2Description: https://datasheet.ciiva.com/2457/pyu-r-int-thick-7-2457203.pdf?src-supplier=Digi-Key; ComponentLink3URL: https://datasheet.ciiva.com/2457/pyu-r-int-thick-7-2457204.pdf?src-supplier=Digi-Key; ComponentLink3Description: https://datasheet.ciiva.com/2457/pyu-r-int-thick-7-2457204.pdf?src-supplier=Digi-Key; ComponentLink4URL: https://datasheet.ciiva.com/2457/pyu-r-int-thick-7-2457205.pdf?src-supplier=Digi-Key; ComponentLink4Description: https://datasheet.ciiva.com/2457/pyu-r-int-thick-7-2457205.pdf?src-supplier=Digi-Key; ComponentLink5URL: https://datasheet.ciiva.com/7941/444164-7941749.pdf?src-supplier=Element14; ComponentLink5Description: https://datasheet.ciiva.com/7941/444164-7941749.pdf?src-supplier=Element14; ComponentLink6URL: https://datasheet.ciiva.com/17419/rc0805-17419894.pdf?src-supplier=Future+Electronics; ComponentLink6Description: https://datasheet.ciiva.com/17419/rc0805-17419894.pdf?src-supplier=Future+Electronics; ComponentLink7URL: https://datasheet.ciiva.com/12577/rc0805-12577399.pdf?src-supplier=Mouser; ComponentLink7Description: https://datasheet.ciiva.com/12577/rc0805-12577399.pdf?src-supplier=Mouser; ComponentLink8URL: https://datasheet.ciiva.com/7660/38627-7660799.pdf?src-supplier=Element14; ComponentLink8Description: https://datasheet.ciiva.com/7660/38627-7660799.pdf?src-supplier=Element14
R17 R18 = CMP-2100-03672-1: Chip Resistor, 3.3 KOhm, +/- 1%, 0.125 W, -55 to 155 degC, 0805 (2012 Metric), RoHS, Tape and Reel; Manufacturer: Yageo; Manufacturer Part Number: RC0805FR-073K3L; Voltage Rating: 150V; Max Power Dissipation: 125mW; Temperature Coefficient: 100ppm/degreesC; Description: RES SMD 3.3K OHM 1% 1/8W 0805; Package Quantity: 1; Max Operating Temperature: 155degC; Case Code (Metric): 2012; Package Reference: 0805; Resistance: 3.3KOhm; Composition: ThickFilm; RoHSCompliant: true; Case/Package: 0805; Case Code (Imperial): 0805; Tolerance: 1%; Depth: 1.25mm; Weight: 0.000194oz; Lead Free: LeadFree; Min Operating Temperature: -55degC; Termination: SMD/SMT; Datasheet Version: Rev. 5, 10/2016; REACH SVHC: NoSVHC; Power Rating: 125mW; Packaging: TapeandReel; Number of Terminations: 2; Width: 0.049inch; Package Description: 2-Pin Surface Mounted Device, Body 2 x 1.25 mm; Datasheet URL: http://www.yageo.com/NewPortal/yageodocoutput?fileName=/pdf/R-Chip/PYu-RC_Group_51_RoHS_L_5.pdf; Height: 0.5mm; Length: 2mm; Manufacturer URL: http://www.yageo.com/; Supplier 1: Digi-Key; Supplier Part Number 1: 311-3.30KCRCT-ND; RoHS: Yes; Category: Chip SMD Resistors; Stock 1: 608723; Pricing 1: 1=0.10000, 10=0.04000, 100=0.01630, 1000=0.00731, 2500=0.00635 (USD); Features: Moisture Resistant; ComponentLink1URL: https://datasheet.ciiva.com/7941/444164-7941782.pdf?src-supplier=Element14; ComponentLink1Description: https://datasheet.ciiva.com/7941/444164-7941782.pdf?src-supplier=Element14; ComponentLink2URL: https://datasheet.ciiva.com/7941/444164-7941783.pdf?src-supplier=Element14; ComponentLink2Description: https://datasheet.ciiva.com/7941/444164-7941783.pdf?src-supplier=Element14; ComponentLink3URL: https://datasheet.ciiva.com/2457/pyu-r-int-thick-7-2457992.pdf?src-supplier=Digi-Key; ComponentLink3Description: https://datasheet.ciiva.com/2457/pyu-r-int-thick-7-2457992.pdf?src-supplier=Digi-Key; ComponentLink4URL: https://datasheet.ciiva.com/2457/pyu-r-int-thick-7-2457993.pdf?src-supplier=Digi-Key; ComponentLink4Description: https://datasheet.ciiva.com/2457/pyu-r-int-thick-7-2457993.pdf?src-supplier=Digi-Key; ComponentLink5URL: https://datasheet.ciiva.com/2457/pyu-r-int-thick-7-2457994.pdf?src-supplier=Digi-Key; ComponentLink5Description: https://datasheet.ciiva.com/2457/pyu-r-int-thick-7-2457994.pdf?src-supplier=Digi-Key; ComponentLink6URL: https://datasheet.ciiva.com/16747/rc0805-16747115.pdf?src-supplier=Future+Electronics; ComponentLink6Description: https://datasheet.ciiva.com/16747/rc0805-16747115.pdf?src-supplier=Future+Electronics; ComponentLink7URL: https://datasheet.ciiva.com/46447/444164-46447579.pdf?src-supplier=Element14; ComponentLink7Description: https://datasheet.ciiva.com/46447/444164-46447579.pdf?src-supplier=Element14; ComponentLink8URL: https://datasheet.ciiva.com/12577/rc0805-12577341.pdf?src-supplier=Mouser; ComponentLink8Description: https://datasheet.ciiva.com/12577/rc0805-12577341.pdf?src-supplier=Mouser
R19 = CMP-2100-03671-1: Chip Resistor, 1 KOhm, +/- 1%, 125 mW, -55 to 155 degC, 0805 (2012 Metric), RoHS, Tape and Reel; Manufacturer: Yageo; Manufacturer Part Number: RC0805FR-071KL; Temperature Coefficient: 100ppm/degreesC; Voltage Rating (DC): 150V; Max Power Dissipation: 125mW; Resistance: 1KOhm; Description: RES SMD 1K OHM 1% 1/8W 0805; Number of Pins: 2; Number of Terminations: 2; Datasheet URL: http://www.yageo.com/NewPortal/yageodocoutput?fileName=/pdf/R-Chip/PYu-RC_Group_51_RoHS_L_5.pdf; Length: 0.079inch; Package Description: 2-Pin Surface Mounted Device, Body 2 x 1.25 mm; Depth: 1.25mm; Height: 0.024inch; Military Standard: Not; Case/Package: 0805; Package Reference: 0805; RoHSCompliant: true; Lead Free: LeadFree; Packaging: TapeandReel; Package Quantity: 1; Datasheet Version: Rev. 5, 10/2016; Tolerance: 1%; Min Operating Temperature: -55degC; Voltage Rating: 150V; Composition: ThickFilm; Case Code (Imperial): 0805; Power Rating: 125mW; Width: 0.049inch; Case Code (Metric): 2012; Manufacturer URL: http://www.yageo.com/; Max Operating Temperature: 155degC; REACH SVHC: Unknown; Termination: SMD/SMT; Supplier 1: Digi-Key; Supplier Part Number 1: 311-1.00KCRCT-ND; RoHS: Yes; Category: Chip SMD Resistors; Stock 1: 24922919; Pricing 1: 1=0.10000, 10=0.04000, 100=0.01630, 1000=0.00731, 2500=0.00635 (USD); Features: Moisture Resistant; ComponentLink1URL: https://datasheet.ciiva.com/2456/pyu-r-int-thick-7-2456976.pdf?src-supplier=Digi-Key; ComponentLink1Description: https://datasheet.ciiva.com/2456/pyu-r-int-thick-7-2456976.pdf?src-supplier=Digi-Key; ComponentLink2URL: https://datasheet.ciiva.com/2456/pyu-r-int-thick-7-2456977.pdf?src-supplier=Digi-Key; ComponentLink2Description: https://datasheet.ciiva.com/2456/pyu-r-int-thick-7-2456977.pdf?src-supplier=Digi-Key; ComponentLink3URL: https://datasheet.ciiva.com/7941/1686128-7941719.pdf?src-supplier=Element14; ComponentLink3Description: https://datasheet.ciiva.com/7941/1686128-7941719.pdf?src-supplier=Element14; ComponentLink4URL: https://datasheet.ciiva.com/16850/rc0805-16850409.pdf?src-supplier=Future+Electronics; ComponentLink4Description: https://datasheet.ciiva.com/16850/rc0805-16850409.pdf?src-supplier=Future+Electronics; ComponentLink5URL: https://datasheet.ciiva.com/46385/444164-46385020.pdf?src-supplier=Element14; ComponentLink5Description: https://datasheet.ciiva.com/46385/444164-46385020.pdf?src-supplier=Element14; ComponentLink6URL: https://datasheet.ciiva.com/2456/pyu-r-int-thick-7-2456975.pdf?src-supplier=Digi-Key; ComponentLink6Description: https://datasheet.ciiva.com/2456/pyu-r-int-thick-7-2456975.pdf?src-supplier=Digi-Key
R20 = CMP-2100-03671-1: Chip Resistor, 2 KOhm, +/- 1%, 125 mW, -55 to 155 degC, 0805 (2012 Metric), RoHS, Tape and Reel; Manufacturer: Yageo; Manufacturer Part Number: RC0805FR-072KL; Description: RES SMD 2K OHM 1% 1/8W 0805; Resistance: 2kR; Power Rating: 125mW; Temperature Coefficient: 100ppm/°C; Voltage Rating (DC): 150V; Supplier 1: Digi-Key; Supplier Part Number 1: 311-2.00KCRCT-ND; RoHS: Yes; Category: Chip SMD Resistors; Stock 1: 3783164; Pricing 1: 1=0.10000, 10=0.04000, 100=0.01630, 1000=0.00731, 2500=0.00635 (USD); Case/Package: 0805; Number of Pins: 2; Case Code (Metric): 2012; Case Code (Imperial): 0805; Min Operating Temperature: -55°C; Max Operating Temperature: 155°C; Tolerance: 1%; Packaging: Tape and Reel; Voltage Rating: 150V; Composition: Thick Film; Termination: SMD/SMT; Military Standard: Not; Number of Terminations: 2; Working Voltage: 150V; Package Quantity: 1; Max Power Dissipation: 125mW; Features: Moisture Resistant; Length: 2mm; Height: 0.024inch; Depth: 1.25mm; Width: 0.049inch; Lead Free: Lead Free; REACH SVHC: No SVHC; ComponentLink1URL: https://datasheet.ciiva.com/11819/0900766b8106beab-11819830.pdf?src-supplier=RSComponents; ComponentLink1Description: https://datasheet.ciiva.com/11819/0900766b8106beab-11819830.pdf?src-supplier=RSComponents; ComponentLink2URL: https://datasheet.ciiva.com/2457/pyu-r-int-thick-7-2457026.pdf?src-supplier=Digi-Key; ComponentLink2Description: https://datasheet.ciiva.com/2457/pyu-r-int-thick-7-2457026.pdf?src-supplier=Digi-Key; ComponentLink3URL: https://datasheet.ciiva.com/2457/pyu-r-int-thick-7-2457027.pdf?src-supplier=Digi-Key; ComponentLink3Description: https://datasheet.ciiva.com/2457/pyu-r-int-thick-7-2457027.pdf?src-supplier=Digi-Key; ComponentLink4URL: https://datasheet.ciiva.com/2457/pyu-r-int-thick-7-2457028.pdf?src-supplier=Digi-Key; ComponentLink4Description: https://datasheet.ciiva.com/2457/pyu-r-int-thick-7-2457028.pdf?src-supplier=Digi-Key; ComponentLink5URL: https://datasheet.ciiva.com/46395/444164-46395128.pdf?src-supplier=Element14; ComponentLink5Description: https://datasheet.ciiva.com/46395/444164-46395128.pdf?src-supplier=Element14; ComponentLink6URL: https://datasheet.ciiva.com/12667/rc0805-12667946.pdf?src-supplier=Mouser; ComponentLink6Description: https://datasheet.ciiva.com/12667/rc0805-12667946.pdf?src-supplier=Mouser
U1-U3 = CMP-0704-00003-2: Zero-Drift, Bi-Directional Current / Power Monitor, 3 to 5.5 V, -40 to 125 degC, 8-pin SOIC (D8), Green (RoHS & no Sb/Br); Manufacturer: Texas Instruments; Common Mode Range(Min)(V): 0; SubFamily: Current Shunt Monitor; Rating: Catalog; Input Offset (+/-)(Max)(uV): 100; Vs(Max)(V): 5.5; Common Mode Range(Max)(V): 26; Quiescent Current (+/-)(Typ)(mA): 0.7; Vs(Min)(V): 3; Gain(V/V): 1, 0.5, 0.25, 0.125; Small-Signal Bandwidth(Typ)(MHz): 0.011; Description: IC CURRENT MONITOR 1% 8SOIC; Common Mode Rejection Ratio: 100dB; Max Supply Voltage: 5.5V; Min Supply Voltage: 3V; Output Current: 10mA; Operating Supply Current: 1mA; Number of Amplifiers: 1; Input Offset Voltage (Vos): 10uV; Accuracy: 1%; Quiescent Current: 700uA; PackageReference: D0008A; ComponentLink1URL: http://www.ti.com/; Eco-Plan: Green (RoHS & no Sb/Br); ComponentLink2URL: http://www.ti.com/general/docs/lit/getliterature.tsp?genericPartNumber=INA219&fileType=pdf; ComponentLink1Description: Manufacturer URL; ComponentLink3Description: Package Specification; Mounting Technology: Surface Mount; PackageDescription: 8-Pin Plastic Small Outline, Body 4.9 x 3.9 mm, Pitch 1.27 mm; ComponentLink3URL: http://www.ti.com/lit/ml/msoi002j/msoi002j.pdf; DatasheetVersion: SBOS448F; PackageVersion: 4040047-3/M, 06/2011; PartNumber: INA219AIDR; Code_JEDEC: MS-012; ComponentLink2Description: Datasheet; CMRR(Min)(dB): 100; Supplier 1: Digi-Key; Supplier Part Number 1: 296-23978-1-ND; Manufacturer Part Number: INA219AIDR; Category: Amplifiers - Op Amps, Buffer, Instrumentation; Stock 1: 5271; Pricing 1: 1=2.14000, 10=1.92200, 25=1.81280, 100=1.45020, 250=1.26896, 500=1.23270, 1000=0.97891 (USD); Case/Package: SOIC; Number of Pins: 8; Weight: 0.002561oz; Contact Plating: Gold; Min Operating Temperature: -40°C; Max Operating Temperature: 125°C; Packaging: Tape and Reel; Package Quantity: 2500; Radiation Hardening: No; REACH SVHC: No SVHC; Lead Free: Lead Free; ComponentLink4URL: https://datasheet.ciiva.com/15132/getdatasheetpartid-306418-15132613.pdf?src-supplier=Verical; ComponentLink4Description: https://datasheet.ciiva.com/15132/getdatasheetpartid-306418-15132613.pdf?src-supplier=Verical; ComponentLink5URL: https://datasheet.ciiva.com/26875/ina219aidr-26875810.pdf?src-supplier=IIIC; ComponentLink5Description: https://datasheet.ciiva.com/26875/ina219aidr-26875810.pdf?src-supplier=IIIC; ComponentLink6URL: https://datasheet.ciiva.com/1939/ina219-1939579.pdf?src-supplier=Digi-Key; ComponentLink6Description: https://datasheet.ciiva.com/1939/ina219-1939579.pdf?src-supplier=Digi-Key; ComponentLink7URL: https://datasheet.ciiva.com/1939/ina219-1939580.pdf?src-supplier=Digi-Key; ComponentLink7Description: https://datasheet.ciiva.com/1939/ina219-1939580.pdf?src-supplier=Digi-Key; ComponentLink8URL: https://datasheet.ciiva.com/1939/ina219-1939581.pdf?src-supplier=Digi-Key; ComponentLink8Description: https://datasheet.ciiva.com/1939/ina219-1939581.pdf?src-supplier=Digi-Key; ComponentLink9URL: https://datasheet.ciiva.com/2965/ina219-2965727.pdf?src-supplier=Avnet; ComponentLink9Description: https://datasheet.ciiva.com/2965/ina219-2965727.pdf?src-supplier=Avnet
U4 = CMP-0244-00194-1: Manufacturer: ON Semiconductor; Manufacturer Part Number: MC78M09CDTRKG; Dropout Voltage: 2V; Number of Outputs: 1; Max Input Voltage: 35V; Max Output Current: 500mA; Power Rating: 5W; Polarity: Positive; Quiescent Current: 6mA; Output Type: Fixed; Supplier 1: Digi-Key; Supplier Part Number 1: MC78M09CDTRKGOSCT-ND; RoHS: Yes; Category: Voltage Regulators - Linear; Stock 1: 7157; Pricing 1: 1=0.43000, 10=0.37000, 25=0.34520, 100=0.25650, 250=0.21708, 500=0.20720, 1000=0.15294 (USD); Mount: Surface Mount; Case/Package: DPAK; Number of Pins: 3; Contact Plating: Tin,Matte; Min Operating Temperature: 0°C; Max Operating Temperature: 125°C; Packaging: Tape and Reel; Output Voltage: 9V; Min Input Voltage: 35V; Output Current: 500mA; Package Quantity: 1; Number of Regulators: 1; Nominal Output Voltage: 9V; Min Output Voltage: 9V; Length: 6.73mm; Height: 2.38mm; Width: 6.22mm; Radiation Hardening: No; REACH SVHC: No SVHC; Lead Free: Lead Free; Halogen Free: Halogen Free; ComponentLink1URL: https://datasheet.ciiva.com/2059/mc78m00-d-2059824.pdf?src-supplier=Digi-Key; ComponentLink1Description: https://datasheet.ciiva.com/2059/mc78m00-d-2059824.pdf?src-supplier=Digi-Key; ComponentLink2URL: https://datasheet.ciiva.com/8234/mc78m00-d-8234074.pdf?src-supplier=Avnet; ComponentLink2Description: https://datasheet.ciiva.com/8234/mc78m00-d-8234074.pdf?src-supplier=Avnet; ComponentLink3URL: https://datasheet.ciiva.com/6591/mc78m00-d-6591293.pdf?src-supplier=Digi-Key; ComponentLink3Description: https://datasheet.ciiva.com/6591/mc78m00-d-6591293.pdf?src-supplier=Digi-Key; ComponentLink4URL: https://datasheet.ciiva.com/2059/mc78m00-d-2059823.pdf?src-supplier=Digi-Key; ComponentLink4Description: https://datasheet.ciiva.com/2059/mc78m00-d-2059823.pdf?src-supplier=Digi-Key